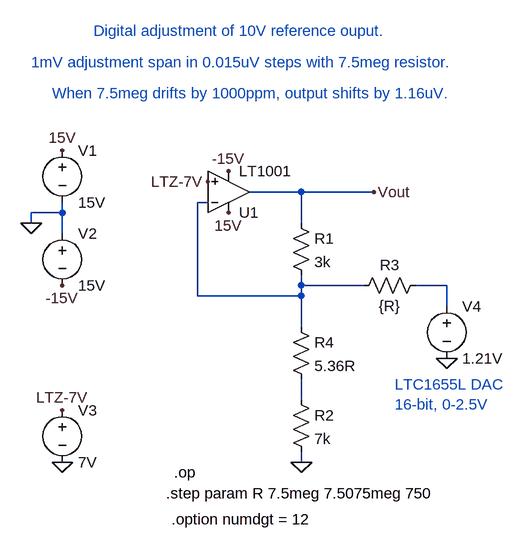
[diagram p0: schematic ltz-digital-adjust-7.5meg.asc]
ltz-digital-adjust-7.5meg.asc, the LTspice schematic file:
Version 4
SHEET 1 1028 680
WIRE 304 128 224 128
WIRE 416 128 304 128
WIRE 160 144 144 144
WIRE -64 160 -64 144
WIRE -64 160 -112 160
WIRE -112 176 -112 160
WIRE 304 176 304 128
WIRE -64 192 -64 160
WIRE 304 272 304 256
WIRE 400 272 304 272
WIRE 528 272 480 272
WIRE 144 288 144 144
WIRE 304 288 304 272
WIRE 304 288 144 288
WIRE 528 304 528 272
WIRE 304 336 304 288
WIRE 304 448 304 416
WIRE 304 544 304 528
FLAG 192 160 15V
FLAG 192 96 -15V
FLAG 160 112 LTZ-7V
FLAG 304 544 0
FLAG 416 128 Vout
FLAG -64 544 0
FLAG -64 464 LTZ-7V
FLAG -64 64 15V
FLAG -64 272 -15V
FLAG -112 176 0
FLAG 528 384 0
SYMBOL Opamps\\LT1001 192 192 M180
SYMATTR InstName U1
SYMBOL res 288 160 R0
SYMATTR InstName R1
SYMATTR Value 3k
SYMBOL res 288 432 R0
SYMATTR InstName R2
SYMATTR Value 7k
SYMBOL voltage -64 48 R0
SYMATTR InstName V1
SYMATTR Value 15V
SYMBOL voltage -64 176 R0
SYMATTR InstName V2
SYMATTR Value 15V
SYMBOL voltage -64 448 R0
SYMATTR InstName V3
SYMATTR Value 7V
SYMBOL res 496 256 R90
WINDOW 0 0 56 VBottom 2
WINDOW 3 32 56 VTop 2
SYMATTR InstName R3
SYMATTR Value {R}
SYMBOL voltage 528 288 R0
SYMATTR InstName V4
SYMATTR Value 1.21V
SYMBOL res 288 320 R0
SYMATTR InstName R4
SYMATTR Value 5.36R
TEXT 108 560 Left 2 !.op
TEXT -112 -72 Left 2 ;1mV adjustment span in 0.015uV steps with 7.5meg resistor.
TEXT 448 424 Left 2 ;LTC1655L DAC\n16-bit, 0-2.5V
TEXT -16 -120 Left 2 ;Digital adjustment of 10V reference ouput.
TEXT -80 -24 Left 2 ;When 7.5meg drifts by 1000ppm, output shifts by 1.16uV.
TEXT 96 592 Left 2 !.step param R 7.5meg 7.5075meg 750
TEXT 104 632 Left 2 !.option numdgt = 12

The netlist it stands for:
* ltz-digital-adjust-7.5meg.asc
XU1 LTZ-7V N001 15V -15V Vout LT1001  ; pins In+ In- V+ V- OUT
R1 Vout N001 3k
R2 N003 0 7k
V1 15V 0 15V
V2 0 -15V 15V
V3 LTZ-7V 0 7V
R3 N002 N001 {R}
V4 N002 0 1.21V
R4 N001 N003 5.36R
.op
* 1mV adjustment span in 0.015uV steps with 7.5meg resistor.
* LTC1655L DAC
* 16-bit, 0-2.5V
* Digital adjustment of 10V reference ouput.
* When 7.5meg drifts by 1000ppm, output shifts by 1.16uV.
.step param R 7.5meg 7.5075meg 750
.option numdgt = 12
.lib LTC.lib
.backanno
.end